# Altium schematic sheet FPC test - connector side.SchDoc
size A
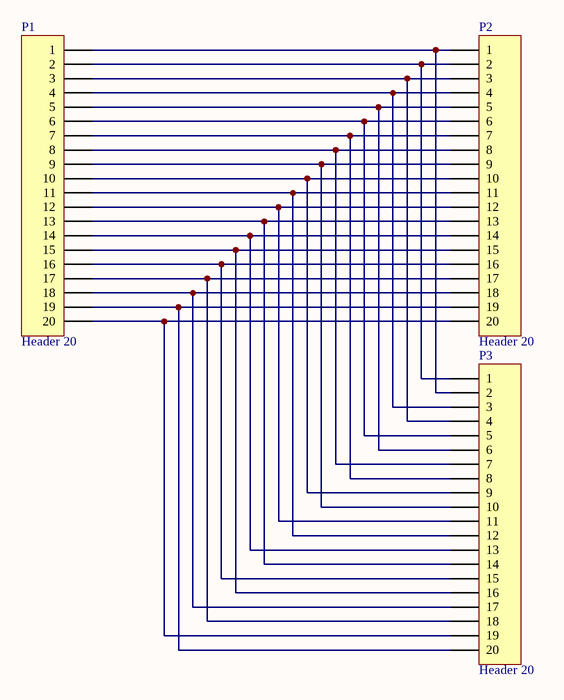
[diagram p0: FPC test - connector side.SchDoc]

## Parts
P1  Header 20  [HDR1X20]
P2  Header 20  [2-1734248-0]
P3  Header 20  [SLW16S-1C7LF]

## Nets
NetP1_1: P1.1 P2.1 P3.2
NetP1_2: P1.2 P2.2 P3.1
NetP1_3: P1.3 P2.3 P3.4
NetP1_4: P1.4 P2.4 P3.3
NetP1_5: P1.5 P2.5 P3.6
NetP1_6: P1.6 P2.6 P3.5
NetP1_7: P1.7 P2.7 P3.8
NetP1_8: P1.8 P2.8 P3.7
NetP1_9: P1.9 P2.9 P3.10
NetP1_10: P1.10 P2.10 P3.9
NetP1_11: P1.11 P2.11 P3.12
NetP1_12: P1.12 P2.12 P3.11
NetP1_13: P1.13 P2.13 P3.14
NetP1_14: P1.14 P2.14 P3.13
NetP1_15: P1.15 P2.15 P3.16
NetP1_16: P1.16 P2.16 P3.15
NetP1_17: P1.17 P2.17 P3.18
NetP1_18: P1.18 P2.18 P3.17
NetP1_19: P1.19 P2.19 P3.20
NetP1_20: P1.20 P2.20 P3.19

## Library data of the parts
P1-P3 = Header 20: Header, 20-Pin; LatestRevisionDate: 17-Jul-2002; LatestRevisionNote: Re-released for DXP Platform.; Publisher: Altium Limited